# EAGLE design r_wiring (EAGLE 7.5.0)
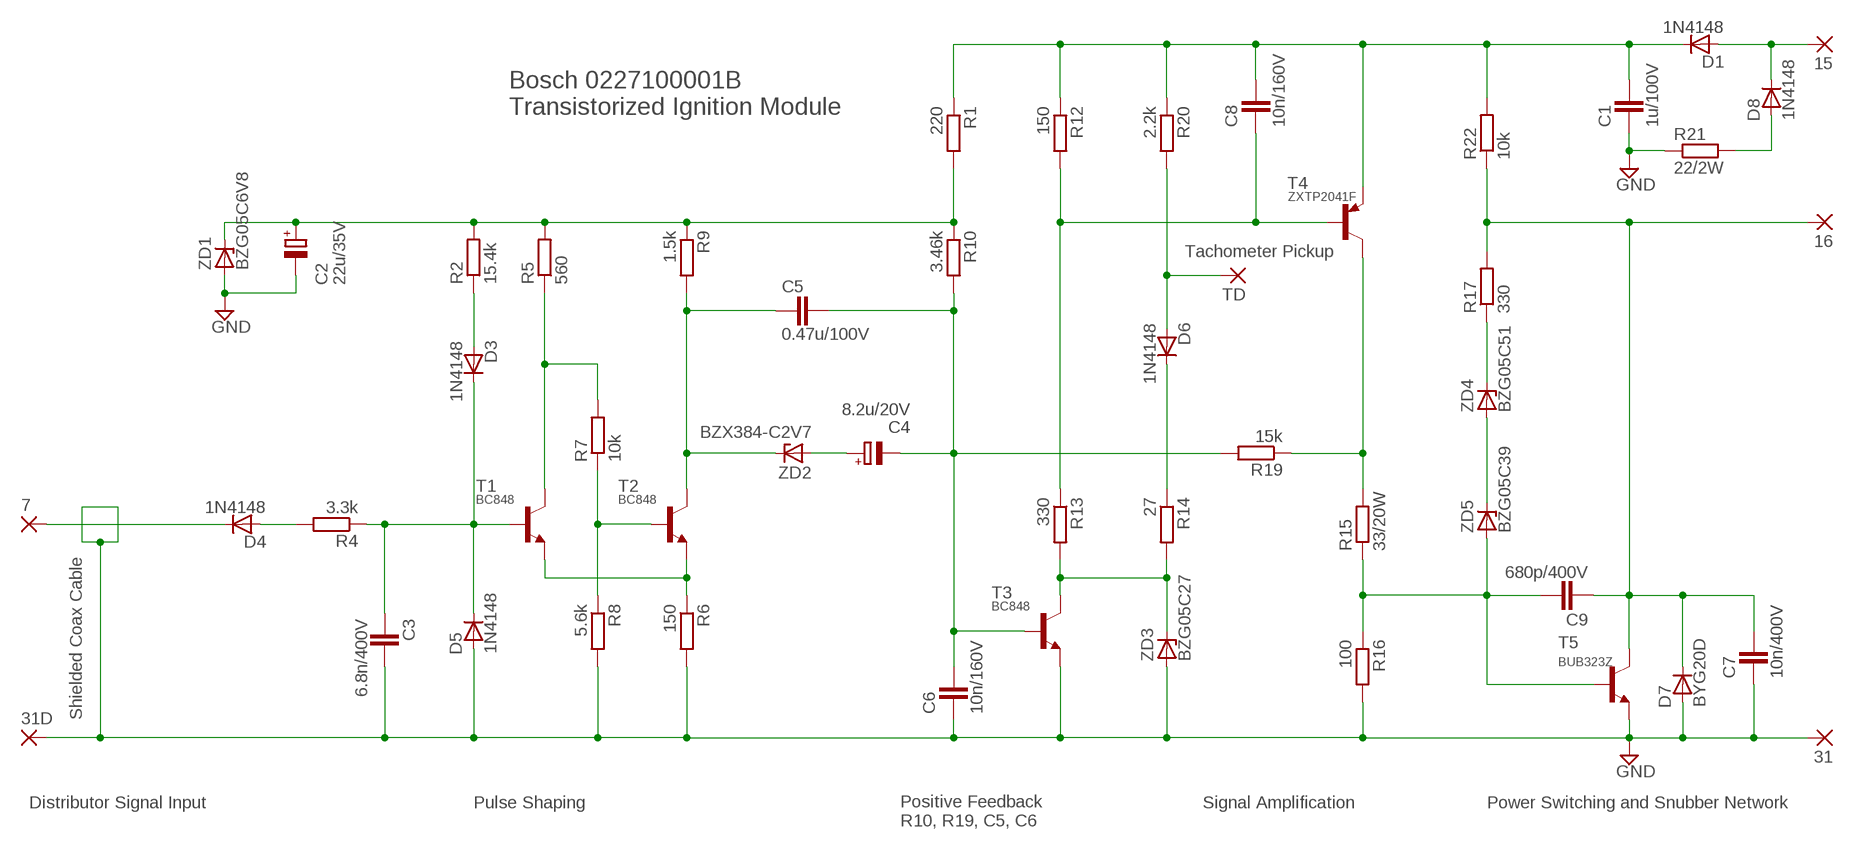
[diagram p0: schematic, sheet 1]

## Parts
7  WIREPADSMD5-2,5  [5-2,5]
15  WIREPADSMD5-2,5  [5-2,5]
16  WIREPADSMD5-2,5  [5-2,5]
31  WIREPADSMD5-2,5  [5-2,5]
31D  WIREPADSMD5-2,5  [5-2,5]
C1  1u/100V  C-EUC1206  [C1206]
C2  22u/35V  CPOL-EUG  [PANASONIC_G]
C3  6.8n/400V  C-EUC1206  [C1206]
C4  8.2u/20V  CPOL-EUG  [PANASONIC_G]
C5  0.47u/100V  C-EUC1206  [C1206]
C6  10n/160V  C-EUC1206  [C1206]
C7  10n/400V  C-EUC1206  [C1206]
C8  10n/160V  C-EUC1206  [C1206]
C9  680p/400V  C-EUC1206  [C1206]
D1  1N4148  DIODE-SOD123  [SOD123]
D3  1N4148  DIODE-SOD123  [SOD123]
D4  1N4148  DIODE-SOD123  [SOD123]
D5  1N4148  DIODE-SOD123  [SOD123]
D6  1N4148  DIODE-SOD123  [SOD123]
D7  BYG20D  DIODE-DO214AC  [DO214AC]
D8  1N4148  DIODE-SOD123  [SOD123]
R1  220  R-EU_R2512  [R2512]
R2  15.4k  R-EU_R2512  [R2512]
R4  3.3k  R-EU_R2512  [R2512]
R5  560  R-EU_R2512  [R2512]
R6  150  R-EU_R2512  [R2512]
R7  10k  R-EU_R2512  [R2512]
R8  5.6k  R-EU_R2512  [R2512]
R9  1.5k  R-EU_R2512  [R2512]
R10  3.46k  R-EU_R2512  [R2512]
R12  150  R-EU_R2512  [R2512]
R13  330  R-EU_R2512  [R2512]
R14  27  R-EU_R2512  [R2512]
R15  33/20W  R-EU_DPAK  [DPAK]
R16  100  R-EU_R2512  [R2512]
R17  330  R-EU_R2512  [R2512]
R19  15k  R-EU_R2512  [R2512]
R20  2.2k  R-EU_R2512  [R2512]
R21  22/2W  R-EU_R2512  [R2512]
R22  10k  R-EU_R2512  [R2512]
T1  BC848  [SOT23]
T2  BC848  [SOT23]
T3  BC848  [SOT23]
T4  ZXTP2041F  -PNP-SOT23-BCE  [SOT23-BCE]
T5  BUB323Z  -NPN-DPAK-BEC  [DPAK]
TD  WIREPADSMD5-2,5  [5-2,5]
ZD1  BZG05C6V8  ZENER-DIODESMB  [SMB]
ZD2  BZX384-C2V7  ZENERSOD-323F  [SOD-323F]
ZD3  BZG05C27  ZENER-DIODESMB  [SMB]
ZD4  BZG05C51  ZENER-DIODESMB  [SMB]
ZD5  BZG05C39  ZENER-DIODESMB  [SMB]

## Nets
GND [high-power]: 31.1(P) 31D.1(P) C1.2 C2.- C3.1 C6.2 C7.2 D5.A D7.A R6.2 R8.2 R16.2 R21.1 T3.2(E) T5.3(E) ZD1.A ZD3.A
N$2: 7.1(P) D4.C
N$3: D4.A R4.2
N$4: C3.2 D3.C D5.C R4.1 T1.1(B)
N$5: R6.1 T1.2(E) T2.2(E)
N$6: R7.1 R8.1 T2.1(B)
N$7: R5.1 R7.2 T1.3(C)
N$8 [power]: C2.+ R1.2 R2.2 R5.2 R9.1 R10.1 ZD1.C
N$9: C4.+ ZD2.A
N$10: D3.A R2.1
N$11: C5.2 R9.2 T2.3(C) ZD2.C
N$12: C4.- C5.1 C6.1 R10.2 R19.2 T3.1(B)
N$13: R15.3 R19.1 T4.C
N$14 [power]: C1.1 C8.1 D1.C R1.1 R12.1 R20.1 R22.2 T4.E
N$15: D6.A R20.2 TD.1(P)
N$16: C8.2 R12.2 R13.1 T4.B
N$17: D6.C R14.1
N$19 [power]: 15.1(P) D1.A D8.C
N$20: D8.A R21.2
N$21: R17.1 ZD4.C
N$22 [high-power]: 16.1(P) C7.1 C9.2 D7.C R17.2 R22.1 T5.4(C)
N$23: ZD4.A ZD5.C
N$25: C9.1 R15.1 R16.1 T5.1(B) ZD5.A
N$26: R13.2 R14.2 T3.3(C) ZD3.C

## Notes on the sheet
- Bosch 0227100001B
  Transistorized Ignition Module
- Tachometer Pickup
- Shielded Coax Cable
- Distributor Signal Input | Pulse Shaping | Signal Amplification | Power Switching and Snubber Network
- Positive Feedback
  R10, R19, C5, C6

## Library data of the parts
7 15 16 31 31D TD = wirepad:WIREPAD: Wire PAD connect wire on PCB
C1 C3 C5-C9 = rcl:C-EU: CAPACITOR, European symbol
C2 C4 = rcl:CPOL-EU: POLARIZED CAPACITOR, European symbol
D1 D3-D8 = diode:DIODE-: DIODE
R1 R2 R4-R10 R12-R14 R17 R20 R21 = resistor:R-EU_: RESISTOR, European symbol
R15 = resistor:R-EU_: RESISTOR, European symbol; VOLTAGE_RATING: >=200V DC
R16 R19 R22 = rcl:R-EU_: RESISTOR, European symbol
T1-T3 = transistor:BC848: NPN TRANSISTOR
T4 = transistor:*-PNP-: PNP Transistror
T5 = transistor-neu-to92:*-NPN-: NPN Transistror
ZD1 ZD3-ZD5 = diode:ZENER-DIODE: Z-Diode
ZD2 = dp_devices:ZENER: Zener Diode SOD-323

## Net classes
0 default: width 1.016 mm, clearance 0.254 mm
1 power: width 1.524 mm, clearance 0.381 mm
2 high-power: width 2.032 mm, clearance 0.508 mm

## Board
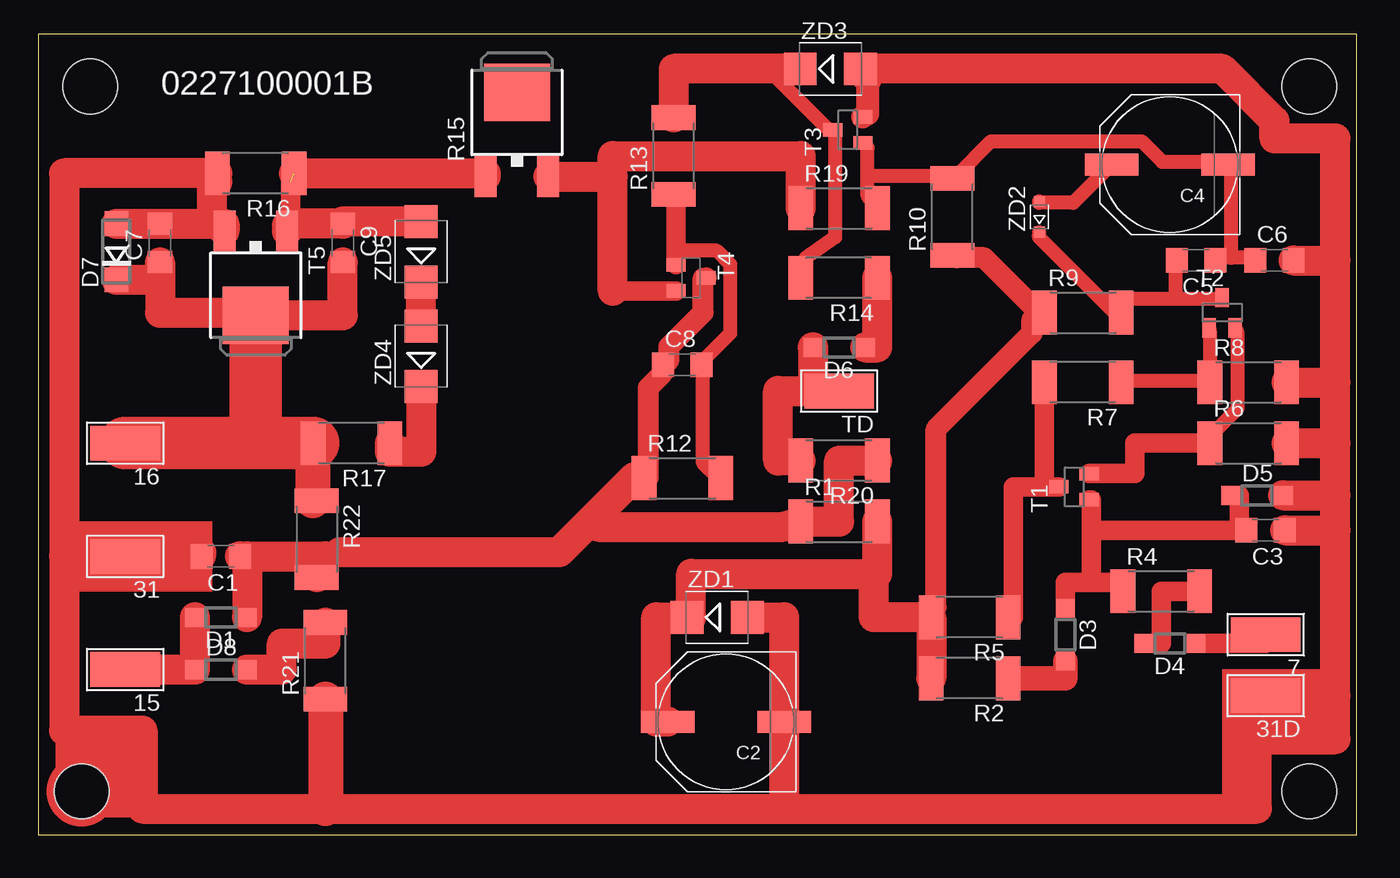
[diagram p1: board, top side]

Size 96.19 x 58.41 mm. Coordinates in mm from the lower left corner, seen from the top.
Outline: 0,0 96.19,0 96.19,58.41 0,58.41 0,0
Copper layers (1*16): Top 0.035mm / dielectric 1.5mm / Bottom 0.035mm
Design rules "SparkFun *": minimum track width 8mil, minimum drill 20mil, track to track 8mil, track to pad 8mil, pad to pad 8mil, via to via 8mil, smd to smd 8mil, copper to edge 8mil, drill to drill 8mil, minimum pad ring 12mil, minimum via ring 10mil, stop-mask expansion 4mil, vias tented up to drill 20mil, thermal gap 10mil
Holes 4 mm at 3.81,54.61 92.71,54.61 3.17,3.17 92.71,3.17

### Footprints (pad centres in the part's own frame; a part is rotated, then mirrored left to right if it is on the bottom)
5-2,5 = smd 2.54 x 5.08: 1 0,0
C1206 = smd 1.6 x 1.8: 1 -1.4,0; 2 1.4,0
PANASONIC_G = smd 3.9 x 1.6: + 4.25,0; - -4.25,0
SOD123 = smd 1.4 x 1.4: A 1.9,0; C -1.9,0
DO214AC = smd 1.8 x 1.7: A 2.05,0; C -2.05,0
R2512 = smd 1.8 x 3.2: 1 -2.8,0; 2 2.8,0
DPAK = smd 1.6 x 3: 1 -2.28,-4.04; 3 2.28,-4.04 | smd 4.826 x 4.191: 4 0,2.096
SOT23 = smd 1 x 1.4: 1 -0.95,-1.1; 2 0.95,-1.1; 3 0,1.1
SOT23-BCE = smd 1 x 1.4: B -0.95,-1.1; C 0.95,-1.1; E 0,1.1
SMB = smd 2.4 x 2.4: A 2.2,0; C -2.2,0
SOD-323F = smd 0.8 x 0.8: A 1.125,0; C -1.125,0

### Placement (x,y rotation side)
7  89.53,14.61 90 top
15  6.35,12.06 90 top
16  6.35,28.58 90 top
31  6.35,20.32 90 top
31D  89.53,10.16 90 top
C1  13.34,20.32 180 top
C2  50.16,8.25 180 top
C3  89.53,22.22 180 top
C4  82.55,48.89 180 top
C5  84.45,41.91 180 top
C6  90.17,41.91 0 top
C7  8.89,43.18 90 top
C8  46.99,34.29 0 top
C9  22.23,43.18 270 top
D1  13.34,15.88 180 top
D3  74.93,14.61 270 top
D4  82.55,13.97 180 top
D5  88.9,24.77 0 top
D6  58.42,35.56 180 top
D7  5.71,42.55 90 top
D8  13.34,12.06 0 top
R1  58.42,22.86 0 top
R2  67.94,11.43 180 top
R4  81.92,17.78 0 top
R5  67.94,15.88 180 top
R6  88.27,28.58 0 top
R7  76.2,33.02 180 top
R8  88.27,33.02 0 top
R9  76.2,38.1 0 top
R10  66.67,45.09 90 top
R12  46.99,26.03 0 top
R13  46.35,49.53 90 top
R14  58.42,40.64 180 top
R15  34.92,52.07 0 top
R16  15.88,48.26 180 top
R17  22.86,28.58 180 top
R19  58.42,45.72 0 top
R20  58.42,27.3 180 top
R21  20.95,12.7 90 top
R22  20.32,21.59 270 top
T1  75.56,25.4 90 top
T2  86.36,38.1 0 top
T3  59.05,51.44 90 top
T4  47.62,40.64 270 top
T5  15.88,40.01 180 top
TD  58.42,32.38 90 top
ZD1  49.53,15.88 0 top
ZD2  73.03,45.09 90 top
ZD3  57.78,55.88 0 top
ZD4  27.94,34.92 90 top
ZD5  27.94,42.55 90 top

### Tracks (layer width: path | path; a pad name or v marks a point on that pad's centre or on a via)
GND
  Top 1.676: 60.5,55.11 60.5,52.61 T3.2
  Top 2.032: 60.5,55.11 ZD3.A | C1.2 12,20.61 11.43,20.32
  Top 2.184: 1.91,20.32 31.1 11.43,20.32 | 1.91,20.32 1.91,7.62 7.62,7.62 7.62,1.9 20.95,1.9 53.98,1.9 | 53.98,1.9 88.9,1.9 88.9,6.98 94.61,6.98 94.61,10.16 | 94.61,10.16 94.61,22.22 | 94.61,22.22 94.61,24.77 | 94.61,24.77 94.61,28.58 | 94.61,28.58 94.61,33.02 | 94.61,33.02 94.61,41.91 | 94.61,41.91 94.61,50.8 90.17,50.8 90.17,52.07 86.36,55.88 ZD3.A | 31D.1 94.61,10.16 | C3.1 94.61,22.22 | D5.A 94.61,24.77 | R6.2 94.61,28.58 | R8.2 94.61,33.02 | C6.2 94.61,41.91 | 53.98,1.9 54.41,2.34 C2.- 54.41,15.88 ZD1.A | D7.A 8.89,44.59 C7.2 12.7,44.58 | T5.3 13.6,44.58 12.7,44.58 | 1.91,20.32 1.91,48.26 R16.2 13.07,47.62 12.7,47.62 12.7,44.58
  Top 2.54: R21.1 20.95,1.9
N$2
  Top 1.422: D4.C 89.53,13.97 7.1
N$3
  Top 1.422: D4.A 81.92,13.97 81.92,17.78 R4.2
N$4
  Top 1.422: D3.C 74.93,18.41 76.83,18.41 | 76.83,18.41 79.11,18.41 R4.1 | T1.1 76.83,24.45 76.83,22.22 | 76.83,22.22 76.83,18.41 | C3.2 87.63,22.22 | 87.63,22.22 76.83,22.22 | D5.C 87.63,24.77 87.63,22.22
N$5
  Top 1.016: T2.2 87.5,36.61 87.5,31.11 85.5,29.11 R6.1
  Top 1.422: T1.2 80.01,26.35 80.01,28.58 R6.1
N$6
  Top 1.016: T2.1 85.5,36.61 85.5,33.11 R8.1 85,33.11 79,33.11 R7.1
N$7
  Top 1.422: R5.1 71.12,15.88 71.12,25.4 T1.3 73.4,25.4 R7.2
N$8
  Top 1.524: 73,38.11 69,42.11 67,42.11 R10.1 | 73,38.11 R9.1 | 73,38.11 72.5,37.61 72.5,36.61 65.5,29.61 65.5,16.61 R5.2
  Top 2.184: C2.+ 45.09,8.25 45.09,15.88 ZD1.C 47.62,15.88 47.62,19.05 60.96,19.05 | 60.96,19.05 61.22,19.05 R1.2 | 60.96,19.05 60.96,15.88 R5.2 R2.2
N$9
  Top 1.016: ZD2.A 73,46.11 75.5,46.11 78,48.61 C4.+
N$10
  Top 1.778: R2.1 74.93,11.43 D3.A
N$11
  Top 1.016: 77.75,38.86 79,37.61 R9.2 | 77.75,38.86 73,43.61 ZD2.C | 83,39.11 78,39.11 77.75,38.86 | 83,39.11 86,39.11 T2.3 | 83,39.11 83,41.61 C5.2
N$12
  Top 1.016: 87,42.11 88.5,42.11 C6.1 | 87,42.11 86,42.11 C5.1 | 87,42.11 87,48.61 C4.- 86.5,49.11 82,49.11 80.5,50.61 69.5,50.61 67,48.11 R10.2 66.5,48.11 60.5,48.11 | 60.5,48.11 60.5,46.61 61,46.11 R19.2 | 60.5,48.11 60.5,50.11 T3.1
N$13
  Top 1.422: T4.C 41.91,39.69
  Top 2.184: R15.3 41.91,48.03 | 41.91,48.03 41.91,49.53 55.62,49.53 R19.1 | 41.91,39.69 41.91,48.03
N$14
  Top 1.524: T4.E 48.5,40.61 48.5,38.11 46,35.61 46,34.61 C8.1 45.5,33.61 44.5,32.61 44.5,26.11 R12.1 43.5,26.11 | 22,20.61 20.95,20.32 | 40.87,22.47 41,23.61
  Top 2.184: C1.1 15.23,20.32 | 15.23,20.32 D1.C | 15.23,20.32 20.95,20.32 R22.2 | R20.1 58.42,27.3 58.42,22.86 R1.1 54.37,22.47 40.87,22.47 | 22,20.61 38,20.61 41,23.61 43.5,26.11
N$15
  Top 2.184: R20.2 53.98,27.3 53.98,32.38 56.52,32.38 | 56.52,32.38 TD.1 | D6.A 56.52,32.38
N$16
  Top 1.016: R12.2 49.5,26.11 48.5,27.11 48.5,34.11 C8.2 48.5,34.61 50.5,36.61 50.5,41.61 49.5,42.61 46.52,42.61
  Top 1.422: R13.1 46.52,46.73 46.52,42.61 T4.B
N$17
  Top 2.184: D6.C 61.22,35.56 R14.1
N$19
  Top 2.184: 15.1 D8.C D1.A
N$20
  Top 2.184: D8.A 17.78,12.06 17.78,13.97 20.95,13.97 R21.2
N$21
  Top 2.184: ZD4.C 27.94,27.94 25.66,27.94 R17.1
N$22
  Top 2.184: D7.C 8.89,40.49 C7.1 8.89,38.1 15.88,38.1 T5.4 22.23,37.91 C9.2 | R22.1 20.06,24.39
  Top 2.54: 20.06,24.39 R17.2
  Top 3.81: R17.2 15.88,28.58 | 15.88,28.58 16.1 | T5.4 15.88,28.58
N$23
  Top 2.184: ZD4.A ZD5.C
N$25  (1 unrouted)
  Top 1.422: 19.05,47.62 18.41,47.62 18.41,44.45
  Top 2.184: ZD5.A 22.23,44.74 C9.1 18.41,44.58 18.41,44.45 18.16,44.45 T5.1 | R16.1 32.65,48.26 R15.1
N$26
  Top 1.016: 54,55.88 54,55.11 57.5,51.61 T3.3 58.13,51.11 58.13,43.61 56,42.11 56,41.11 R14.2
  Top 2.184: ZD3.C 54,55.88 46.35,55.88 R13.2
(copper drawn outside any net)
  shapes: Top area x7, Top circle x1

### Text on the board
tNames: 0227100001B